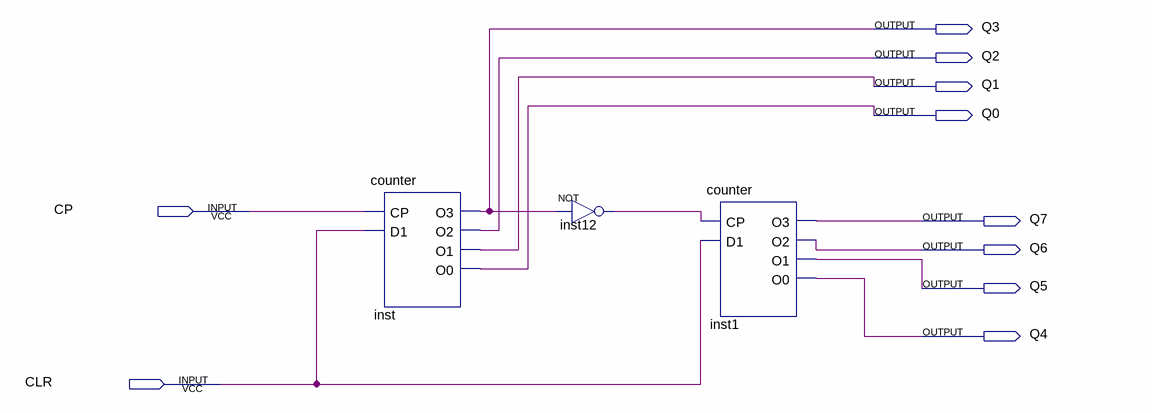
[diagram p0: schematic sheet]
// Quartus schematic COUNTER-256.bdf as structural Verilog: 3 symbols, 10 pins
module \COUNTER-256  (
  input  CP,
  input  CLR,
  output Q3,
  output Q2,
  output Q1,
  output Q0,
  output Q7,
  output Q6,
  output Q5,
  output Q4
);

  wire inst12_out;

  counter inst (.CP(CP), .D1(CLR), .O3(Q3), .O2(Q2), .O1(Q1), .O0(Q0));
  not inst12 (inst12_out, Q3);
  counter inst1 (.CP(inst12_out), .D1(CLR), .O3(Q7), .O2(Q6), .O1(Q5), .O0(Q4));
endmodule
